# EAGLE design AD breakout (EAGLE 9.2.2)
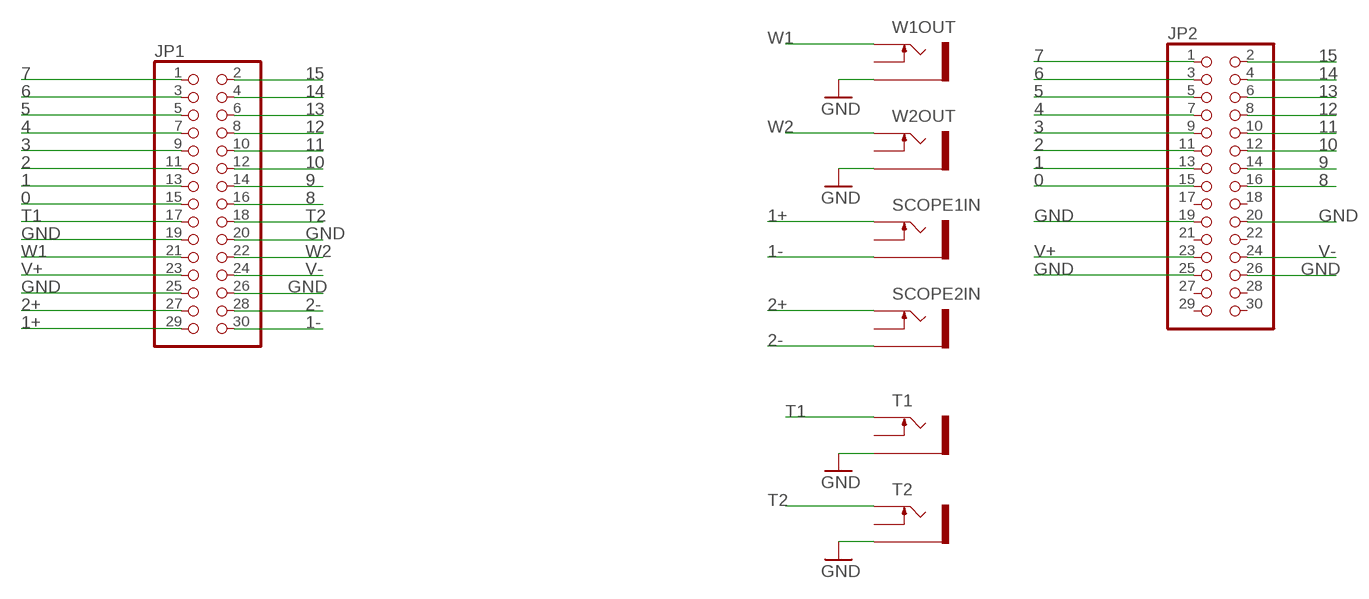
[diagram p0: schematic, sheet 1]

## Parts
JP1  PINHD-2X15  [2X15]
JP2  PINHD-2X15  [2X15]
SCOPE1IN  THONKICONNNEW  [WQP-PJ301M-12_JACK]
SCOPE2IN  THONKICONNNEW  [WQP-PJ301M-12_JACK]
T1  THONKICONNNEW  [WQP-PJ301M-12_JACK]
T2  THONKICONNNEW  [WQP-PJ301M-12_JACK]
W1OUT  THONKICONNNEW  [WQP-PJ301M-12_JACK]
W2OUT  THONKICONNNEW  [WQP-PJ301M-12_JACK]

## Nets
0: JP1.15 JP2.15
1: JP1.13 JP2.13
1+: JP1.29 SCOPE1IN.P$1_TIP(TIP)
1-: JP1.30 SCOPE1IN.P$3_SLEEVE(SLEEVE)
2: JP1.11 JP2.11
2+: JP1.27 SCOPE2IN.P$1_TIP(TIP)
2-: JP1.28 SCOPE2IN.P$3_SLEEVE(SLEEVE)
3: JP1.9 JP2.9
4: JP1.7 JP2.7
5: JP1.5 JP2.5
6: JP1.3 JP2.3
7: JP1.1 JP2.1
8: JP1.16 JP2.16
9: JP1.14 JP2.14
10: JP1.12 JP2.12
11: JP1.10 JP2.10
12: JP1.8 JP2.8
13: JP1.6 JP2.6
14: JP1.4 JP2.4
15: JP1.2 JP2.2
GND: JP1.19 JP1.20 JP1.25 JP1.26 JP2.19 JP2.20 JP2.25 JP2.26 T1.P$3_SLEEVE(SLEEVE) T2.P$3_SLEEVE(SLEEVE) W1OUT.P$3_SLEEVE(SLEEVE) W2OUT.P$3_SLEEVE(SLEEVE)
T1: JP1.17 T1.P$1_TIP(TIP)
T2: JP1.18 T2.P$1_TIP(TIP)
V+: JP1.23 JP2.23
V-: JP1.24 JP2.24
W1: JP1.21 W1OUT.P$1_TIP(TIP)
W2: JP1.22 W2OUT.P$1_TIP(TIP)
Unconnected: JP2.17 JP2.18 JP2.21 JP2.22 JP2.27 JP2.28 JP2.29 JP2.30 SCOPE1IN.P$2_SWITCH(SWITCH) SCOPE2IN.P$2_SWITCH(SWITCH) T1.P$2_SWITCH(SWITCH) T2.P$2_SWITCH(SWITCH) W1OUT.P$2_SWITCH(SWITCH) W2OUT.P$2_SWITCH(SWITCH)

## Library data of the parts
JP1 JP2 = pinhead:PINHD-2X15: PIN HEADER
SCOPE1IN SCOPE2IN T1 T2 W1OUT W2OUT = MusicThingModular:THONKICONN: 3.5mm socket for Eurorack modular synths

## Board
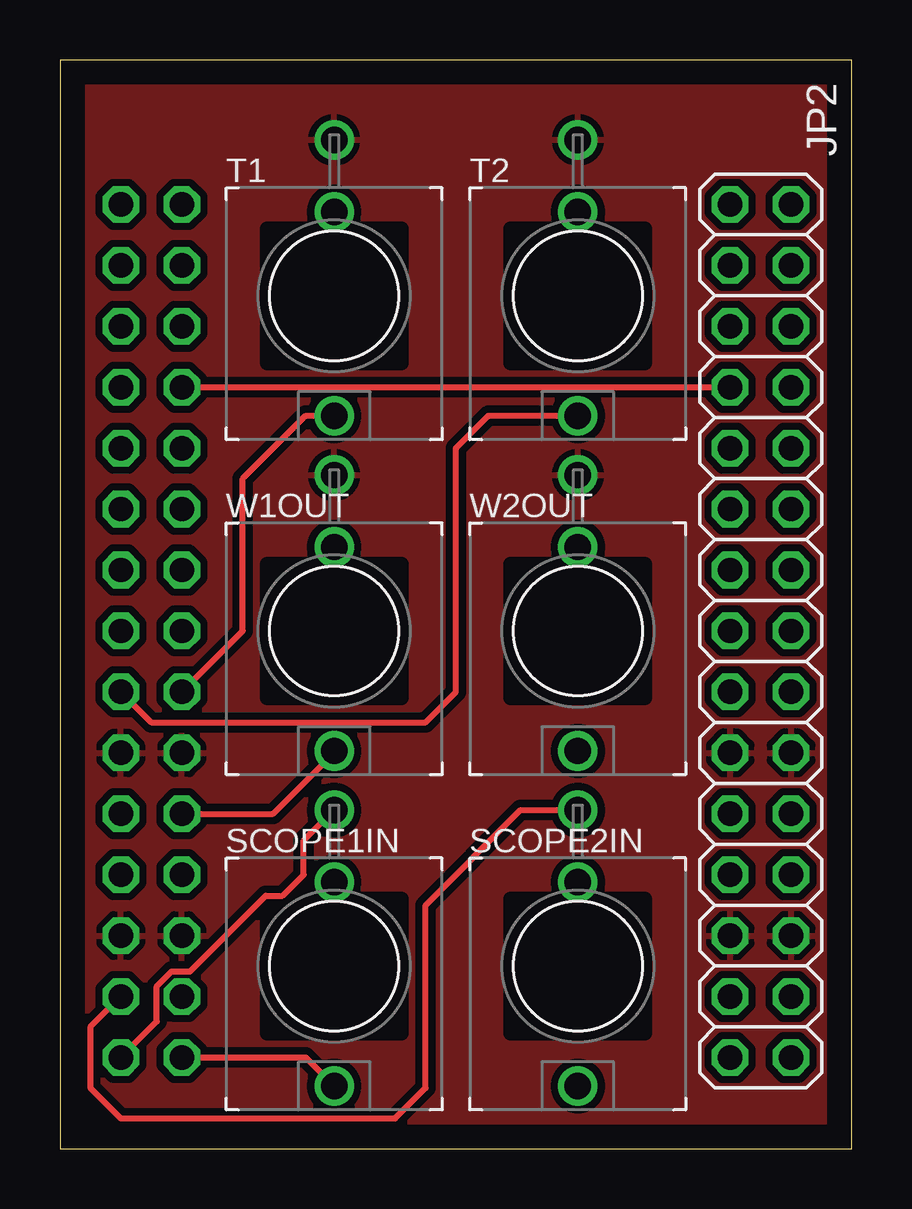
[diagram p1: board, top side]
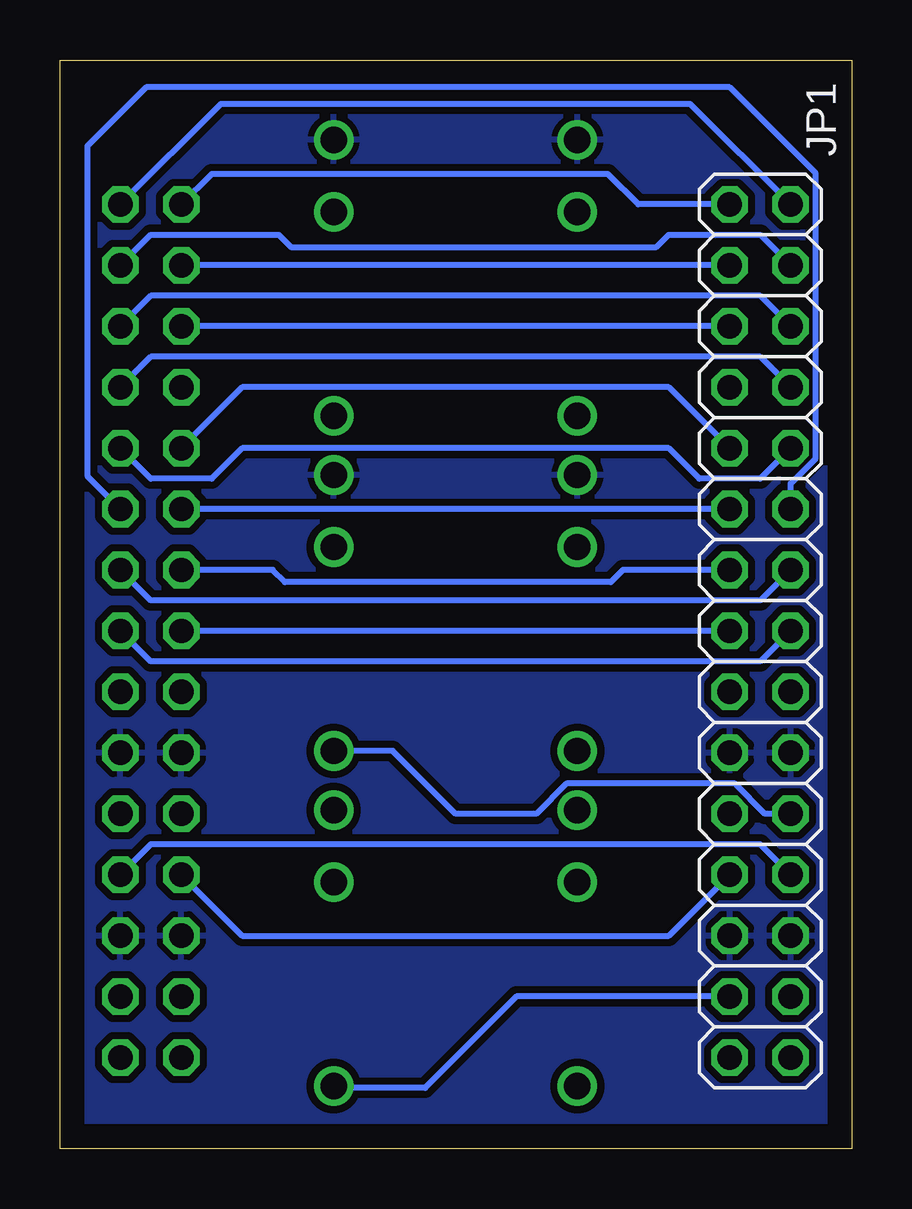
[diagram p2: board, bottom side, seen from below]

Size 33 x 45.39 mm. Coordinates in mm from the lower left corner, seen from the top.
Outline: 0,0 33,0 33,45.39 0,45.39 0,0
Copper layers (1*16): Top 0.035mm / dielectric 1.5mm / Bottom 0.035mm
Design rules "default": minimum track width 6mil, minimum drill 0.35mm, track to track 6mil, track to pad 6mil, pad to pad 6mil, via to via 6mil, smd to smd 6mil, copper to edge 40mil, drill to drill 6mil, minimum pad ring 10mil, minimum via ring 8mil, stop-mask expansion 4mil, vias tented up to drill 0mil, thermal gap 10mil

### Footprints (pad centres in the part's own frame; a part is rotated, then mirrored left to right if it is on the bottom)
2X15 = drill 1.016 octagon: 1 -17.78,-1.27; 2 -17.78,1.27; 3 -15.24,-1.27; 4 -15.24,1.27; 5 -12.7,-1.27; 6 -12.7,1.27; 7 -10.16,-1.27; 8 -10.16,1.27; 9 -7.62,-1.27; 10 -7.62,1.27; 11 -5.08,-1.27; 12 -5.08,1.27; 13 -2.54,-1.27; 14 -2.54,1.27; 15 0,-1.27; 16 0,1.27; 17 2.54,-1.27; 18 2.54,1.27; 19 5.08,-1.27; 20 5.08,1.27; 21 7.62,-1.27; 22 7.62,1.27; 23 10.16,-1.27; 24 10.16,1.27; 25 12.7,-1.27; 26 12.7,1.27; 27 15.24,-1.27; 28 15.24,1.27; 29 17.78,-1.27; 30 17.78,1.27
WQP-PJ301M-12_JACK = drill 1.1: P$1_TIP 0,5; P$2_SWITCH 0,-3.5; P$3_SLEEVE 0,-6.5

### Placement (x,y rotation side)
JP1  3.81,21.59 270 bottom
JP2  29.21,21.59 270 top
SCOPE1IN  11.43,7.62 180 top
SCOPE2IN  21.59,7.62 180 top
T1  11.43,35.56 180 top
T2  21.59,35.56 180 top
W1OUT  11.43,21.59 180 top
W2OUT  21.59,21.59 180 top

### Tracks (layer width: path | path; a pad name or v marks a point on that pad's centre or on a via)
0
  Bottom 0.254: JP1.15 JP2.15
1
  Bottom 0.254: JP1.13 9.53,24.13 10.03,23.62 23.62,23.62 24.13,24.13 JP2.13
1+
  Top 0.254: JP1.29 10.24,3.81 SCOPE1IN.P$1_TIP
1-
  Top 0.254: JP1.30 4.04,5.31 4.04,6.78 4.65,7.39 5.42,7.39 8.58,10.55 9.28,10.55 10.16,11.43 10.16,12.85 SCOPE1IN.P$3_SLEEVE
2
  Bottom 0.254: JP1.11 JP2.11
2+
  Bottom 0.254: JP1.27 13.97,6.35 17.78,2.54 21.59,2.54 SCOPE2IN.P$1_TIP
2-
  Top 0.254: JP1.28 1.27,5.08 1.27,2.54 2.54,1.27 13.97,1.27 15.24,2.54 15.24,10.16 19.2,14.12 SCOPE2IN.P$3_SLEEVE
3
  Bottom 0.254: JP1.9 7.62,31.75 25.4,31.75 JP2.9
4
  Top 0.254: JP1.7 JP2.7
5
  Bottom 0.254: JP1.5 JP2.5
6
  Bottom 0.254: JP1.3 JP2.3
7
  Bottom 0.254: JP1.1 8.89,39.37 10.16,40.64 26.67,40.64 JP2.1
8
  Bottom 0.254: JP1.16 3.81,20.32 29.21,20.32 JP2.16
9
  Bottom 0.254: JP1.14 3.81,22.86 29.21,22.86 JP2.14
10
  Bottom 0.254: JP1.12 2.54,27.74 1.5,28.78 1.5,40.67 5.08,44.25 29.41,44.25 31.86,41.8 31.86,28.05 JP2.12
11
  Bottom 0.254: JP1.10 3.81,27.94 6.35,27.94 7.62,29.21 25.4,29.21 26.67,27.94 29.21,27.94 JP2.10
12
  Bottom 0.254: JP1.8 3.81,33.02 29.21,33.02 JP2.8
13
  Bottom 0.254: JP1.6 3.81,35.56 29.21,35.56 JP2.6
14
  Bottom 0.254: JP2.4 29.21,38.1 23.88,38.1 23.37,37.59 8.13,37.59 7.62,38.1 3.81,38.1 JP1.4
15
  Bottom 0.254: JP1.2 6.73,43.56 26.29,43.56 JP2.2
GND
  pour Top (isolate 0.305): 0,0 0,45.39 33.02,45.39 33.02,0
  pour Bottom (isolate 0.305): 0,45.39 0,0 33.02,0 33.02,45.39
T1
  Top 0.254: JP1.17 7.62,21.59 7.62,27.94 10.24,30.56 T1.P$1_TIP
T2
  Top 0.254: JP1.18 3.81,17.78 15.24,17.78 16.51,19.05 16.51,29.21 17.86,30.56 T2.P$1_TIP
V+
  Bottom 0.254: JP1.23 7.62,8.89 25.4,8.89 JP2.23
V-
  Bottom 0.254: JP1.24 3.81,12.7 29.21,12.7 JP2.24
W1
  Top 0.254: JP1.21 8.89,13.97 11.43,16.51 W1OUT.P$1_TIP
W2
  Bottom 0.254: JP1.22 3.61,13.97 4.86,15.22 11.89,15.22 13.14,13.97 16.51,13.97 19.13,16.59 W2OUT.P$1_TIP